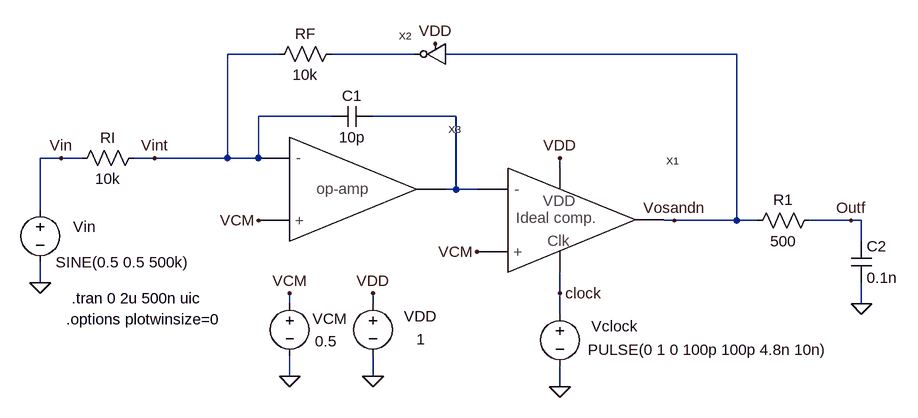
[diagram p0: schematic _Fig6_30_MSD.asc]
_Fig6_30_MSD.asc, the LTspice schematic file:
Version 4
SHEET 1 928 680
WIRE -48 -144 -128 -144
WIRE 160 -144 32 -144
WIRE 656 -144 208 -144
WIRE 32 -48 -80 -48
WIRE 224 -48 96 -48
WIRE -384 16 -416 16
WIRE -352 16 -384 16
WIRE -240 16 -272 16
WIRE -128 16 -128 -144
WIRE -128 16 -240 16
WIRE -80 16 -80 -48
WIRE -80 16 -128 16
WIRE 384 32 384 16
WIRE 224 64 224 -48
WIRE 224 64 208 64
WIRE 256 64 224 64
WIRE -416 96 -416 16
WIRE 560 112 544 112
WIRE 656 112 656 -144
WIRE 656 112 560 112
WIRE 688 112 656 112
WIRE 832 112 768 112
WIRE 848 112 832 112
WIRE 848 144 848 112
WIRE -416 208 -416 176
WIRE 384 224 384 192
WIRE -32 240 -32 224
WIRE 96 240 96 224
WIRE 848 240 848 208
WIRE 384 256 384 224
WIRE -32 352 -32 320
WIRE 96 352 96 320
WIRE 384 368 384 336
FLAG 96 352 0
FLAG 384 16 VDD
FLAG 96 224 VDD
FLAG 384 368 0
FLAG 384 224 clock
FLAG -32 352 0
FLAG -32 224 VCM
FLAG 560 112 Vosandn
FLAG -416 208 0
FLAG -384 16 Vin
FLAG -240 16 Vint
FLAG 256 160 VCM
FLAG 192 -160 VDD
FLAG -80 112 VCM
FLAG 848 240 0
FLAG 832 112 Outf
SYMBOL Ideal_clocked_comparator 304 112 R0
SYMATTR InstName X1
SYMBOL voltage 96 224 R0
WINDOW 0 48 35 Left 0
WINDOW 3 67 71 Left 0
SYMATTR InstName VDD
SYMATTR Value 1
SYMBOL voltage 384 240 R0
WINDOW 0 48 35 Left 0
WINDOW 3 43 71 Left 0
WINDOW 123 0 0 Left 0
WINDOW 39 0 0 Left 0
SYMATTR InstName Vclock
SYMATTR Value PULSE(0 1 0 100p 100p 4.8n 10n)
SYMBOL voltage -32 224 R0
WINDOW 0 35 39 Left 0
WINDOW 3 39 74 Left 0
SYMATTR InstName VCM
SYMATTR Value 0.5
SYMBOL cap 32 -32 R270
WINDOW 0 32 32 VTop 0
WINDOW 3 0 32 VBottom 0
SYMATTR InstName C1
SYMATTR Value 10p
SYMBOL res -256 0 R90
WINDOW 0 0 56 VBottom 0
WINDOW 3 32 56 VTop 0
SYMATTR InstName RI
SYMATTR Value 10k
SYMBOL res 48 -160 R90
WINDOW 0 0 56 VBottom 0
WINDOW 3 32 56 VTop 0
SYMATTR InstName RF
SYMATTR Value 10k
SYMBOL voltage -416 80 R0
WINDOW 0 51 42 Left 0
WINDOW 123 0 0 Left 0
WINDOW 39 0 0 Left 0
SYMATTR InstName Vin
SYMATTR Value SINE(0.5 0.5 500k)
SYMBOL inverter 208 -144 M0
SYMATTR InstName X2
SYMBOL op_amp -32 64 R0
SYMATTR InstName X3
SYMBOL res 784 96 R90
WINDOW 0 0 56 VBottom 0
WINDOW 3 32 56 VTop 0
SYMATTR InstName R1
SYMATTR Value 500
SYMBOL cap 832 144 R0
SYMATTR InstName C2
SYMATTR Value 0.1n
TEXT -368 232 Left 0 !.tran 0 2u 500n uic
TEXT -376 264 Left 0 !.options plotwinsize=0

The netlist it stands for:
* _Fig6_30_MSD.asc
XX1 N002 VCM Vosandn VDD clock Ideal_clocked_comparator  ; pins Vinm Vinp Vout VDD Clock
VDD VDD 0 1
Vclock clock 0 PULSE(0 1 0 100p 100p 4.8n 10n)
VCM VCM 0 0.5
C1 Vint N002 10p
RI Vint Vin 10k
RF N001 Vint 10k
Vin Vin 0 SINE(0.5 0.5 500k)
XX2 Vosandn N001 VDD inverter  ; pins In Out VDD
XX3 Vint VCM N002 op_amp  ; pins Vinm Vinp Out
R1 Outf Vosandn 500
C2 Outf 0 0.1n
.tran 0 2u 500n uic
.options plotwinsize=0
.backanno
.end